# Altium schematic sheet main.SchDoc
size A4
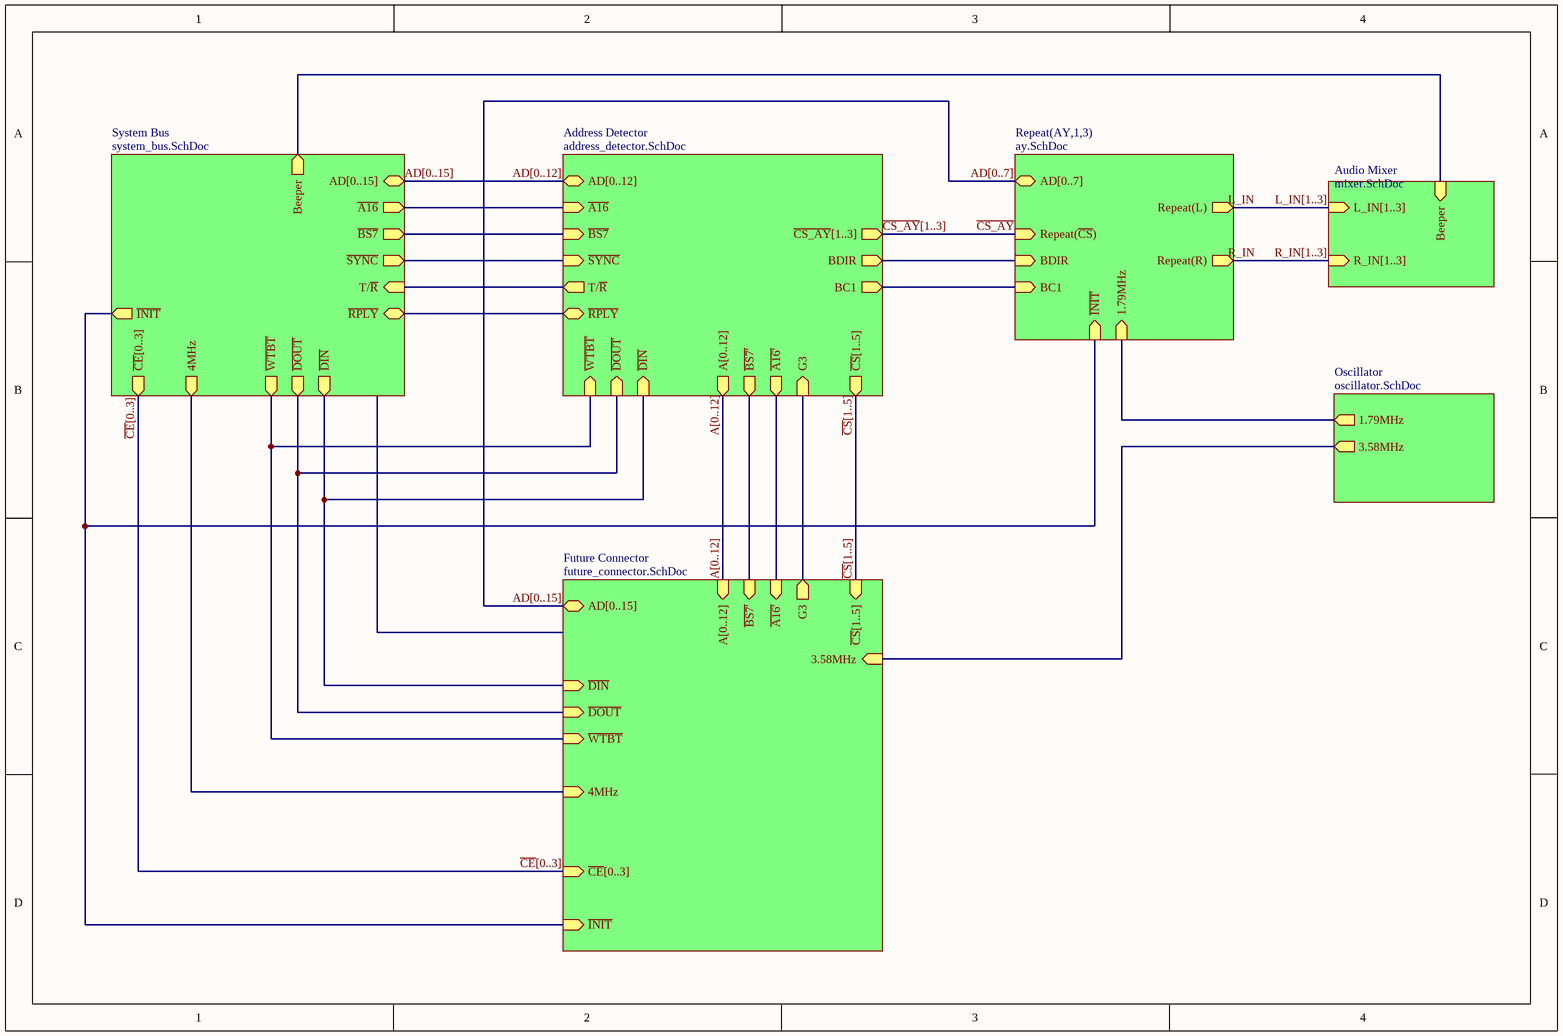
[diagram p0: main.SchDoc]

## Sub-sheets
Address Detector = address_detector.SchDoc: ~{BS7} (in), ~{CS_AY}[1..3] (out), AD[0..12] (bidir), ~{A16} (in), ~{SYNC} (in), A[0..12] (out), ~{BS7'} (out), ~{A16'} (out), ~{CS}[1..5] (out), ~{DOUT} (in), BDIR (out), ~{WTBT} (in), T/~{R} (out), BC1 (out), ~{DIN} (in), ~{RPLY} (bidir), G3 (in)
Audio Mixer = mixer.SchDoc: L_IN[1..3] (in), R_IN[1..3] (in), Beeper (in)
Future Connector = future_connector.SchDoc: AD[0..15] (bidir), A[0..12] (in), ~{CS}[1..5] (in), ~{A16'} (in), ~{BS7'} (in), 3.58MHz (in), ~{DIN} (in), ~{WTBT} (in), ~{CE}[0..3] (in), ~{DOUT} (in), ~{INIT} (in), 4MHz (in), G3 (out)
Oscillator = oscillator.SchDoc: 1.79MHz (out), 3.58MHz (out)
Repeat(AY,1,3) = ay.SchDoc: Repeat(~{CS}) (in), Repeat(L) (out), ~{INIT} (in), AD[0..7] (bidir), 1.79MHz (in), Repeat(R) (out), BC1 (in), BDIR (in)
System Bus = system_bus.SchDoc: AD[0..15] (bidir), ~{BS7} (out), ~{SYNC} (out), ~{DOUT} (out), ~{A16} (out), ~{DIN} (out), ~{WTBT} (out), ~{INIT} (out), ~{CE}[0..3] (out), T/~{R} (in), ~{RPLY} (bidir), 4MHz (out), Beeper (out)

## Nets
~{CS_AY}: sheet Repeat(AY,1,3)/Repeat(~{CS})
(unnamed): sheet Repeat(AY,1,3)/~{INIT}, sheet System Bus/~{INIT}, sheet Future Connector/~{INIT}
(unnamed): sheet Repeat(AY,1,3)/1.79MHz, sheet Oscillator/1.79MHz
(unnamed): sheet Repeat(AY,1,3)/BC1, sheet Address Detector/BC1
(unnamed): sheet Repeat(AY,1,3)/BDIR, sheet Address Detector/BDIR
(unnamed): sheet Oscillator/3.58MHz, sheet Future Connector/3.58MHz
(unnamed): sheet Audio Mixer/Beeper, sheet System Bus/Beeper
(unnamed): sheet System Bus/~{BS7}, sheet Address Detector/~{BS7}
(unnamed): sheet System Bus/~{SYNC}, sheet Address Detector/~{SYNC}
(unnamed): sheet System Bus/~{DOUT}, sheet Address Detector/~{DOUT}, sheet Future Connector/~{DOUT}
(unnamed): sheet System Bus/~{A16}, sheet Address Detector/~{A16}
(unnamed): sheet System Bus/~{DIN}, sheet Address Detector/~{DIN}, sheet Future Connector/~{DIN}
(unnamed): sheet System Bus/~{WTBT}, sheet Address Detector/~{WTBT}, sheet Future Connector/~{WTBT}
(unnamed): sheet System Bus/T/~{R}, sheet Address Detector/T/~{R}
(unnamed): sheet System Bus/~{RPLY}, sheet Address Detector/~{RPLY}
(unnamed): sheet System Bus/4MHz, sheet Future Connector/4MHz
(unnamed): sheet Address Detector/~{BS7'}, sheet Future Connector/~{BS7'}
(unnamed): sheet Address Detector/~{A16'}, sheet Future Connector/~{A16'}
(unnamed): sheet Address Detector/G3, sheet Future Connector/G3

## Buses and harness runs
bus A[0..12]
bus A[0..12] = sheet Address Detector/A[0..12] = sheet Future Connector/A[0..12]
bus AD[0..7] = AD[0..12] = AD[0..15] = sheet Address Detector/AD[0..12] = sheet Future Connector/AD[0..15] = sheet Repeat(AY,1,3)/AD[0..7] = sheet System Bus/AD[0..15]
bus L_IN[1..3] = sheet Audio Mixer/L_IN[1..3]
bus R_IN[1..3] = sheet Audio Mixer/R_IN[1..3]
bus ~{CE}[0..3] = sheet Future Connector/~{CE}[0..3] = sheet System Bus/~{CE}[0..3]
bus ~{CS_AY}[1..3] = sheet Address Detector/~{CS_AY}[1..3]
bus ~{CS}[1..5]
bus ~{CS}[1..5] = sheet Address Detector/~{CS}[1..5] = sheet Future Connector/~{CS}[1..5]

## Notes on the sheet
- Labels drawn without touching a wire or pin: A[0..12], L_IN, R_IN, ~{CS}[1..5]